# Altium schematic sheet Master.SchDoc
size C
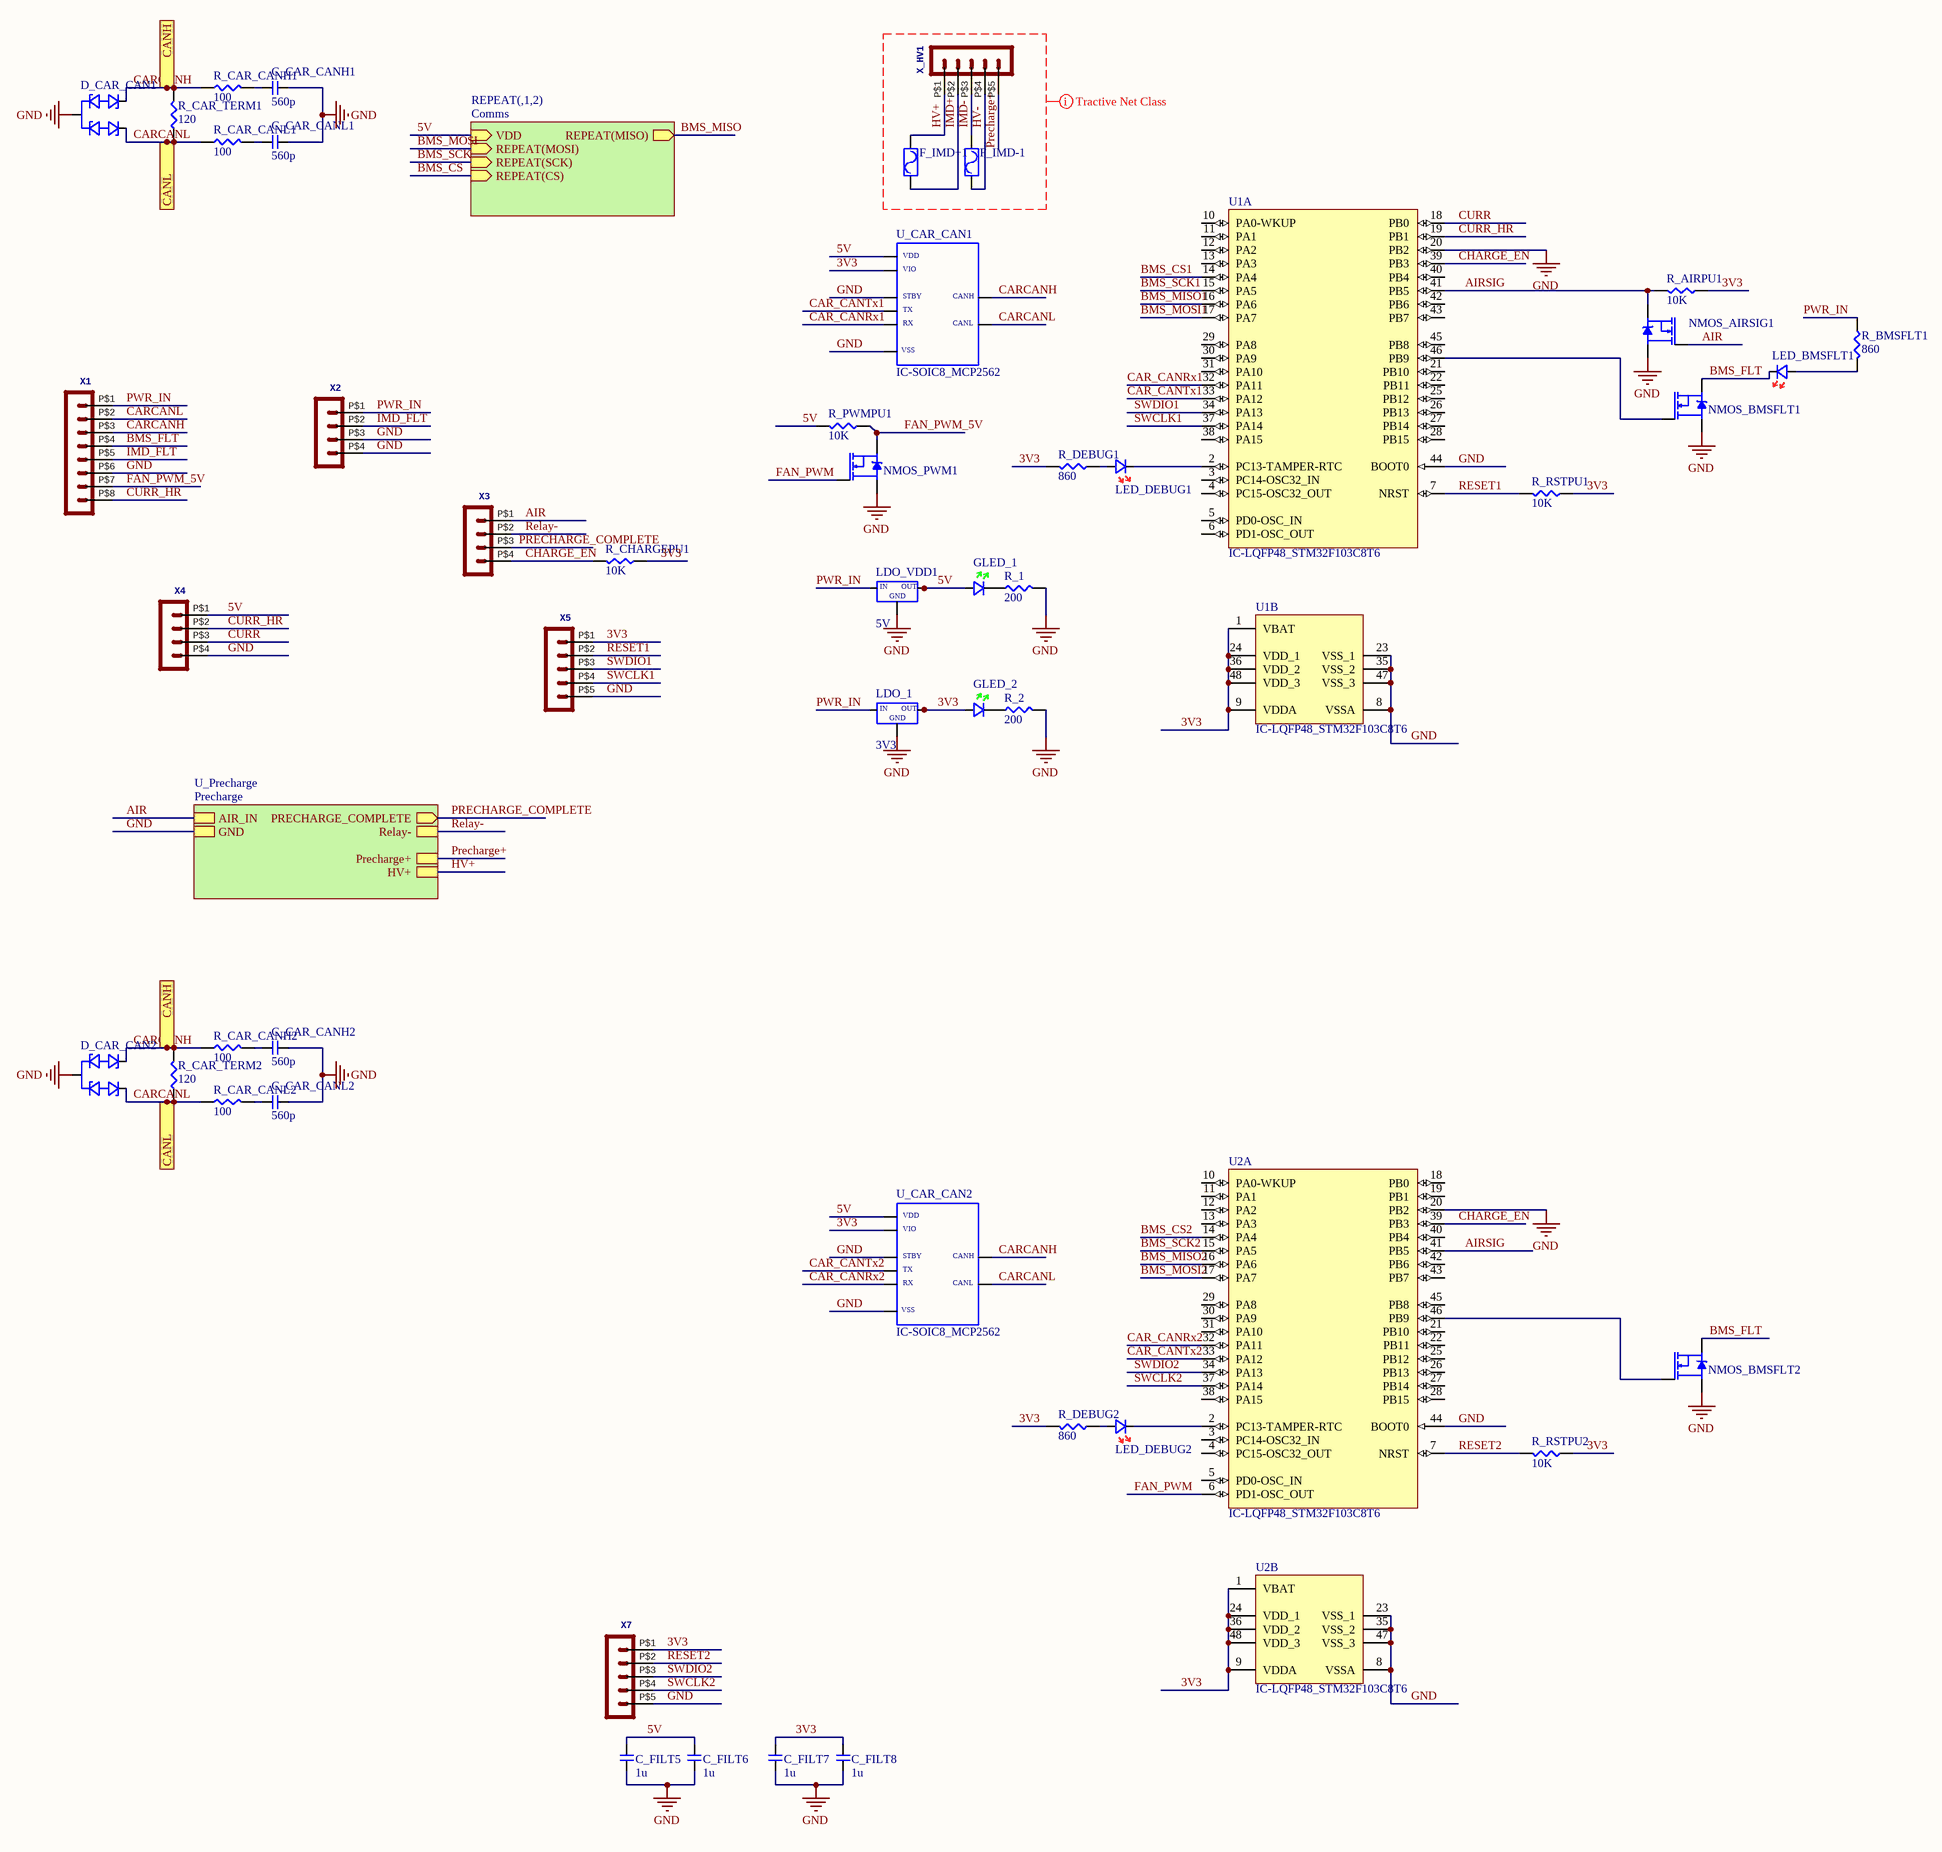
[diagram p0: Master.SchDoc]

## Parts
C_CAR_CANH1  560p  [CAP-0603]
C_CAR_CANH2  560p  [CAP-0603]
C_CAR_CANL1  560p  [CAP-0603]
C_CAR_CANL2  560p  [CAP-0603]
C_FILT5  1u  [CAP-0603]
C_FILT6  1u  [CAP-0603]
C_FILT7  1u  [CAP-0603]
C_FILT8  1u  [CAP-0603]
D_CAR_CAN1  DIODE-SOT23_PESD1CAN  [SOT23]  (value not drawn)
D_CAR_CAN2  DIODE-SOT23_PESD1CAN  [SOT23]  (value not drawn)
F_IMD+1  FUSE_885  [FUSE_885]  (value not drawn)
F_IMD-1  FUSE_885  [FUSE_885]  (value not drawn)
GLED_1  (no value)  [LEDGREEN-0603]
GLED_2  (no value)  [LEDGREEN-0603]
LDO_1  3V3  [SOT223]
LDO_VDD1  5V  [SOT223]
LED_BMSFLT1  LEDRED-0603  [LEDRED-0603]  (value not drawn)
LED_DEBUG1  LEDRED-0603  [LEDRED-0603]  (value not drawn)
LED_DEBUG2  LEDRED-0603  [LEDRED-0603]  (value not drawn)
NMOS_AIRSIG1  NMOS-SOT23  [SOT23]  (value not drawn)
NMOS_BMSFLT1  NMOS-SOT23  [SOT23]  (value not drawn)
NMOS_BMSFLT2  NMOS-SOT23  [SOT23]  (value not drawn)
NMOS_PWM1  NMOS-SOT23  [SOT23]  (value not drawn)
R_1  200  [RES-0603]
R_2  200  [RES-0603]
R_AIRPU1  10K  [RES-0603]
R_BMSFLT1  860  [RES-0603]
R_CAR_CANH1  100  [RES-0603]
R_CAR_CANH2  100  [RES-0603]
R_CAR_CANL1  100  [RES-0603]
R_CAR_CANL2  100  [RES-0603]
R_CAR_TERM1  120  [RES-0603]
R_CAR_TERM2  120  [RES-0603]
R_CHARGEPU1  10K  [RES-0603]
R_DEBUG1  860  [RES-0603]
R_DEBUG2  860  [RES-0603]
R_PWMPU1  10K  [RES-0603]
R_RSTPU1  10K  [RES-0603]
R_RSTPU2  10K  [RES-0603]
U1  IC-LQFP48_STM32F103C8T6  [STM-LQFP48_M]  (parts A,B of 2)
U2  IC-LQFP48_STM32F103C8T6  [STM-LQFP48_M]  (parts A,B of 2)
U_CAR_CAN1  IC-SOIC8_MCP2562  [SOIC8]
U_CAR_CAN2  IC-SOIC8_MCP2562  [SOIC8]
X1  Molex - Micro-Fit 3.0 Series connector,  3.00mm (0.118") pitch header, 8 positions.  [43650-0824]  (value not drawn)
X2  Molex - Micro-Fit 3.0 Series connector,  3.00mm (0.118") pitch header, 4 positions.  [43650-0424]  (value not drawn)
X3  Molex - Micro-Fit 3.0 Series connector,  3.00mm (0.118") pitch header, 4 positions.  [43650-0424]  (value not drawn)
X4  Molex - Micro-Fit 3.0 Series connector,  3.00mm (0.118") pitch header, 4 positions.  [43650-0424]  (value not drawn)
X5  (no value)  [POS5_254MM_MALE]
X7  (no value)  [POS5_254MM_MALE]
X_HV1  Molex - Micro-Fit 3.0 Series connector,  3.00mm (0.118") pitch header, 5 positions.  [43650-0524]  (value not drawn)

## Sub-sheets
REPEAT(,1,2) = Comms: VDD (in), REPEAT(MOSI) (in), REPEAT(MISO) (out), REPEAT(SCK) (in), REPEAT(CS) (in)
U_Precharge = Precharge: PRECHARGE_COMPLETE (out), AIR_IN, GND, Precharge+, HV+, Relay-

## Ports
CANH, CANL

## Nets
GND: C_CAR_CANH1.2 C_CAR_CANH2.2 C_CAR_CANL1.2 C_CAR_CANL2.2 C_FILT5.1 C_FILT6.1 C_FILT7.1 C_FILT8.1 D_CAR_CAN1.3(G) D_CAR_CAN2.3(G) LDO_1.1 LDO_VDD1.1 NMOS_AIRSIG1.2(S) NMOS_BMSFLT1.2(S) NMOS_BMSFLT2.2(S) NMOS_PWM1.2(S) R_1.2 R_2.2 U1.8(VSSA) U1.20(PB2) U1.23(VSS_1) U1.35(VSS_2) U1.44(BOOT0) U1.47(VSS_3) U2.8(VSSA) U2.20(PB2) U2.23(VSS_1) U2.35(VSS_2) U2.44(BOOT0) U2.47(VSS_3) U_CAR_CAN1.2 U_CAR_CAN1.8 U_CAR_CAN2.2 U_CAR_CAN2.8 X1.P$6 X2.P$3 X2.P$4 X4.P$4 X5.P$5 X7.P$5 ; sheet U_Precharge/GND
3V3: C_FILT7.2 C_FILT8.2 GLED_2.A LDO_1.2 LDO_1.4 R_AIRPU1.1 R_CHARGEPU1.1 R_DEBUG1.2 R_DEBUG2.2 R_RSTPU1.1 R_RSTPU2.1 U1.1(VBAT) U1.9(VDDA) U1.24(VDD_1) U1.36(VDD_2) U1.48(VDD_3) U2.1(VBAT) U2.9(VDDA) U2.24(VDD_1) U2.36(VDD_2) U2.48(VDD_3) U_CAR_CAN1.5 U_CAR_CAN2.5 X5.P$1 X7.P$1
5V: C_FILT5.2 C_FILT6.2 GLED_1.A LDO_VDD1.2 LDO_VDD1.4 R_PWMPU1.1 U_CAR_CAN1.3 U_CAR_CAN2.3 X4.P$1 ; sheet REPEAT(,1,2)/VDD
AIR: NMOS_AIRSIG1.1(G) X3.P$1 ; sheet U_Precharge/AIR_IN
AIRSIG: NMOS_AIRSIG1.3(D) R_AIRPU1.2 U1.41(PB5) U2.41(PB5)
BMS_CS: sheet REPEAT(,1,2)/REPEAT(CS)
BMS_CS1: U1.14(PA4)
BMS_CS2: U2.14(PA4)
BMS_FLT: LED_BMSFLT1.K NMOS_BMSFLT1.3(D) NMOS_BMSFLT2.3(D) X1.P$4
BMS_MISO: sheet REPEAT(,1,2)/REPEAT(MISO)
BMS_MISO1: U1.16(PA6)
BMS_MISO2: U2.16(PA6)
BMS_MOSI: sheet REPEAT(,1,2)/REPEAT(MOSI)
BMS_MOSI1: U1.17(PA7)
BMS_MOSI2: U2.17(PA7)
BMS_SCK: sheet REPEAT(,1,2)/REPEAT(SCK)
BMS_SCK1: U1.15(PA5)
BMS_SCK2: U2.15(PA5)
CAR_CANRx1: U1.32(PA11) U_CAR_CAN1.4
CAR_CANRx2: U2.32(PA11) U_CAR_CAN2.4
CAR_CANTx1: U1.33(PA12) U_CAR_CAN1.1
CAR_CANTx2: U2.33(PA12) U_CAR_CAN2.1
CARCANH: D_CAR_CAN1.2(CAN2) D_CAR_CAN2.2(CAN2) R_CAR_CANH1.1 R_CAR_CANH2.1 R_CAR_TERM1.2 R_CAR_TERM2.2 U_CAR_CAN1.7 U_CAR_CAN2.7 X1.P$3 ; port CANH
CARCANL: D_CAR_CAN1.1(CAN1) D_CAR_CAN2.1(CAN1) R_CAR_CANL1.1 R_CAR_CANL2.1 R_CAR_TERM1.1 R_CAR_TERM2.1 U_CAR_CAN1.6 U_CAR_CAN2.6 X1.P$2 ; port CANL
CHARGE_EN: R_CHARGEPU1.2 U1.39(PB3) U2.39(PB3) X3.P$4
CURR: U1.18(PB0) X4.P$3
CURR_HR: U1.19(PB1) X1.P$8 X4.P$2
FAN_PWM: NMOS_PWM1.1(G) U2.6(PD1-OSC_OUT)
FAN_PWM_5V: NMOS_PWM1.3(D) R_PWMPU1.2 X1.P$7
HV+: F_IMD+1.1 X_HV1.P$1 ; sheet U_Precharge/HV+
HV-: F_IMD-1.2 X_HV1.P$4
IMD+: F_IMD+1.2 X_HV1.P$2
IMD-: F_IMD-1.1 X_HV1.P$3
IMD_FLT: X1.P$5 X2.P$2
Precharge+: X_HV1.P$5 ; sheet U_Precharge/Precharge+
PRECHARGE_COMPLETE: X3.P$3 ; sheet U_Precharge/PRECHARGE_COMPLETE
PWR_IN: LDO_1.3 LDO_VDD1.3 R_BMSFLT1.2 X1.P$1 X2.P$1
Relay-: X3.P$2 ; sheet U_Precharge/Relay-
RESET1: R_RSTPU1.2 U1.7(NRST) X5.P$2
RESET2: R_RSTPU2.2 U2.7(NRST) X7.P$2
SWCLK1: U1.37(PA14) X5.P$4
SWCLK2: U2.37(PA14) X7.P$4
SWDIO1: U1.34(PA13) X5.P$3
SWDIO2: U2.34(PA13) X7.P$3
NetC_CAR_CANH1_1: C_CAR_CANH1.1 R_CAR_CANH1.2
NetC_CAR_CANH2_1: C_CAR_CANH2.1 R_CAR_CANH2.2
NetC_CAR_CANL1_1: C_CAR_CANL1.1 R_CAR_CANL1.2
NetC_CAR_CANL2_1: C_CAR_CANL2.1 R_CAR_CANL2.2
NetGLED_1_K: GLED_1.K R_1.1
NetGLED_2_K: GLED_2.K R_2.1
NetLED_BMSFLT1_A: LED_BMSFLT1.A R_BMSFLT1.1
NetLED_DEBUG1_A: LED_DEBUG1.A R_DEBUG1.1
NetLED_DEBUG1_K: LED_DEBUG1.K U1.2(PC13-TAMPER-RTC)
NetLED_DEBUG2_A: LED_DEBUG2.A R_DEBUG2.1
NetLED_DEBUG2_K: LED_DEBUG2.K U2.2(PC13-TAMPER-RTC)
NetNMOS_BMSFLT1_1: NMOS_BMSFLT1.1(G) U1.46(PB9)
NetNMOS_BMSFLT2_1: NMOS_BMSFLT2.1(G) U2.46(PB9)

Not connected (* = marked no-connect by the designer): U1 3(PC14-OSC32_IN) 4(PC15-OSC32_OUT) 5(PD0-OSC_IN) 6(PD1-OSC_OUT) 10(PA0-WKUP) 11(PA1) 12(PA2) 13(PA3) 21(PB10) 22(PB11) 25(PB12) 26(PB13) 27(PB14) 28(PB15) 29(PA8) 30(PA9) 31(PA10) 38(PA15) 40(PB4) 42(PB6) 43(PB7) 45(PB8); U2 3(PC14-OSC32_IN) 4(PC15-OSC32_OUT) 5(PD0-OSC_IN) 10(PA0-WKUP) 11(PA1) 12(PA2) 13(PA3) 18(PB0) 19(PB1) 21(PB10) 22(PB11) 25(PB12) 26(PB13) 27(PB14) 28(PB15) 29(PA8) 30(PA9) 31(PA10) 38(PA15) 40(PB4) 42(PB6) 43(PB7) 45(PB8)

## Layout directives
net class Tractive: HV+, HV-, IMD+, IMD-, Precharge+

## Notes on the sheet
- (in symbol IC-SOIC8_MCP2562) VDD; VIO; STBY; CANH; TX; RX; CANL; VSS
- (in symbol LDO-SOT223_SPX1117) IN; OUT; GND

## Library data of the parts
C_CAR_CANH1 C_CAR_CANH2 C_CAR_CANL1 C_CAR_CANL2 C_FILT5-C_FILT8 = CAP-0603
GLED_1 GLED_2 = LEDGREEN-0603
LDO_1 LDO_VDD1 = LDO-SOT223_SPX1117
R_1 R_2 R_AIRPU1 R_BMSFLT1 R_CAR_CANH1 R_CAR_CANH2 R_CAR_CANL1 R_CAR_CANL2 R_CAR_TERM1 R_CAR_TERM2 R_CHARGEPU1 R_DEBUG1 R_DEBUG2 R_PWMPU1 R_RSTPU1 R_RSTPU2 = RES-0603
U1 U2 = IC-LQFP48_STM32F103C8T6: A/D Converter: 2x12-bit (10 Channel); Core: ARM Cortex-M3; FLASH Size (Prog) (kB): 64; I/Os (High Current): 37; Internal RAM Size (kB): 20; Operating Frequency(F) (Processor speed) (MHz): 72; Packing: Tray; Supply Voltage(Vcc) min (V): 2; DatasheetVersion: Rev. 16; PackageVersion: Rev. 6, 06/2013; PackageReference: LQFP48; PackageDescription: 48-Pin Low Profile Quad Flat Package, 7 x 7 mm Body, 0.5 mm Pitch; Supplier 1: Digi-Key; Supplier Part Number 1: 497-6063-ND; Supplier 2: Farnell; Supplier Part Number 2: 1447637; Supplier 3: Newark; Supplier Part Number 3: 59M2182; Supplier 4: Newark; Supplier Part Number 4: 57P1222; Supplier 5: Mouser; Supplier Part Number 5: 511-STM32F103C8T6; Mounting Technology: Surface Mount; PartNumber: STM32F103C8T6; ComponentLink1Description: Manufacturer URL; ComponentLink1URL: http://www.st.com/web/en/home.html; ComponentLink2Description: Datasheet; ComponentLink2URL: http://www.st.com/st-web-ui/static/active/en/resource/technical/document/datasheet/CD00161566.pdf; ComponentLink3Description: Package Specification; ComponentLink3URL: http://www.st.com/st-web-ui/static/active/en/resource/technical/document/datasheet/DM00058181.pdf
X1 = HEADER_POS8_?43650-0824: GateName_1: G$1; SymbolName_1: HEADER_POS8; DeviceName: 43650-0824; LibraryName: MOLEX Micro-Fit; DeviceSetName: HEADER_POS8_?; Package: 43650-0824
X2-X4 = POS4_MF43650-0424: GateName_1: G$1; SymbolName_1: HEADER_POS4; DeviceSetName: HEADER_POS4_?; DeviceName: 43650-0424; LibraryName: MOLEX Micro-Fit; Package: 43650-0424
X5 X7 = POS5_254MM_MALE: GateName_1: G$1; SymbolName_1: HEADER_POS5; DeviceName: 43650-0524; DeviceSetName: HEADER_POS5_?; LibraryName: MOLEX Micro-Fit; Package: 43650-0524
X_HV1 = POS5_MF43650-0524: GateName_1: G$1; SymbolName_1: HEADER_POS5; DeviceSetName: HEADER_POS5_?; DeviceName: 43650-0524; LibraryName: MOLEX Micro-Fit; Package: 43650-0524